# EAGLE design DEC3 (EAGLE 9.4.2)
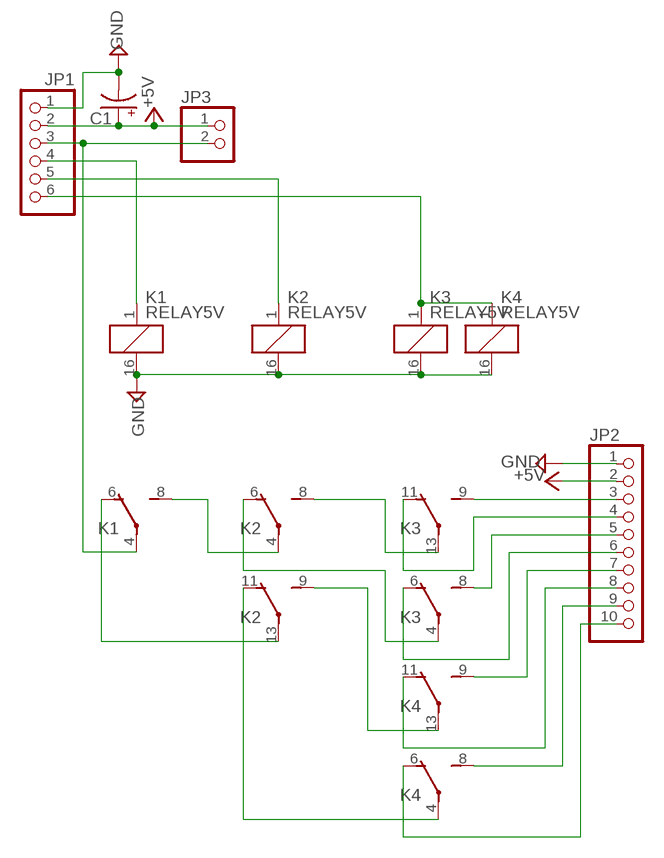
[diagram p0: schematic, sheet 1]

## Parts
C1  CC-5-8.5  [E5-8,5]
JP1  PINHD-1X6  [1X06]
JP2  PINHD-1X10  [1X10]
JP3  PINHD-1X2  [1X02]
K1  RELAY5V  [DS-BT]
K2  RELAY5V  [DS-BT]
K3  RELAY5V  [DS-BT]
K4  RELAY5V  [DS-BT]

## Nets
+5V: C1.+ JP1.2 JP2.2 JP3.1
GND: C1.- JP1.1 JP2.1 K1.16(1:-) K2.16(1:-) K3.16(1:-) K4.16(1:-)
N$1: K1.8(2:S) K2.4(2:P)
N$2: K1.6(2:O) K2.13(3:P)
N$3: K2.8(2:S) K3.13(3:P)
N$4: K2.6(2:O) K3.4(2:P)
N$5: K2.9(3:S) K4.13(3:P)
N$6: K2.11(3:O) K4.4(2:P)
N$7: JP2.3 K3.9(3:S)
N$8: JP2.4 K3.11(3:O)
N$9: JP2.5 K3.8(2:S)
N$10: JP2.6 K3.6(2:O)
N$11: JP2.7 K4.9(3:S)
N$12: JP2.8 K4.11(3:O)
N$13: JP2.9 K4.8(2:S)
N$14: JP2.10 K4.6(2:O)
N$16: JP1.6 K3.1(1:+) K4.1(1:+)
N$19: JP1.4 K1.1(1:+)
N$20: JP1.5 K2.1(1:+)
N$35: JP1.3 JP3.2 K1.4(2:P)
Unconnected: K1.9(3:S) K1.11(3:O) K1.13(3:P)

## Library data of the parts
C1 = Passive_Robotech:CC
JP1 = pinhead:PINHD-1X6: PIN HEADER
JP2 = pinhead:PINHD-1X10: PIN HEADER
JP3 = pinhead:PINHD-1X2: PIN HEADER
K1-K4 = My:RELAY: DS-BT RELAYS 4,000 V BREAKDOWN VOLTAGE NAiS Source: http://www.mew-europe.com/.. en_ds_61005_0010.pdf

## Net classes
0 default: width 0.406 mm

## Board
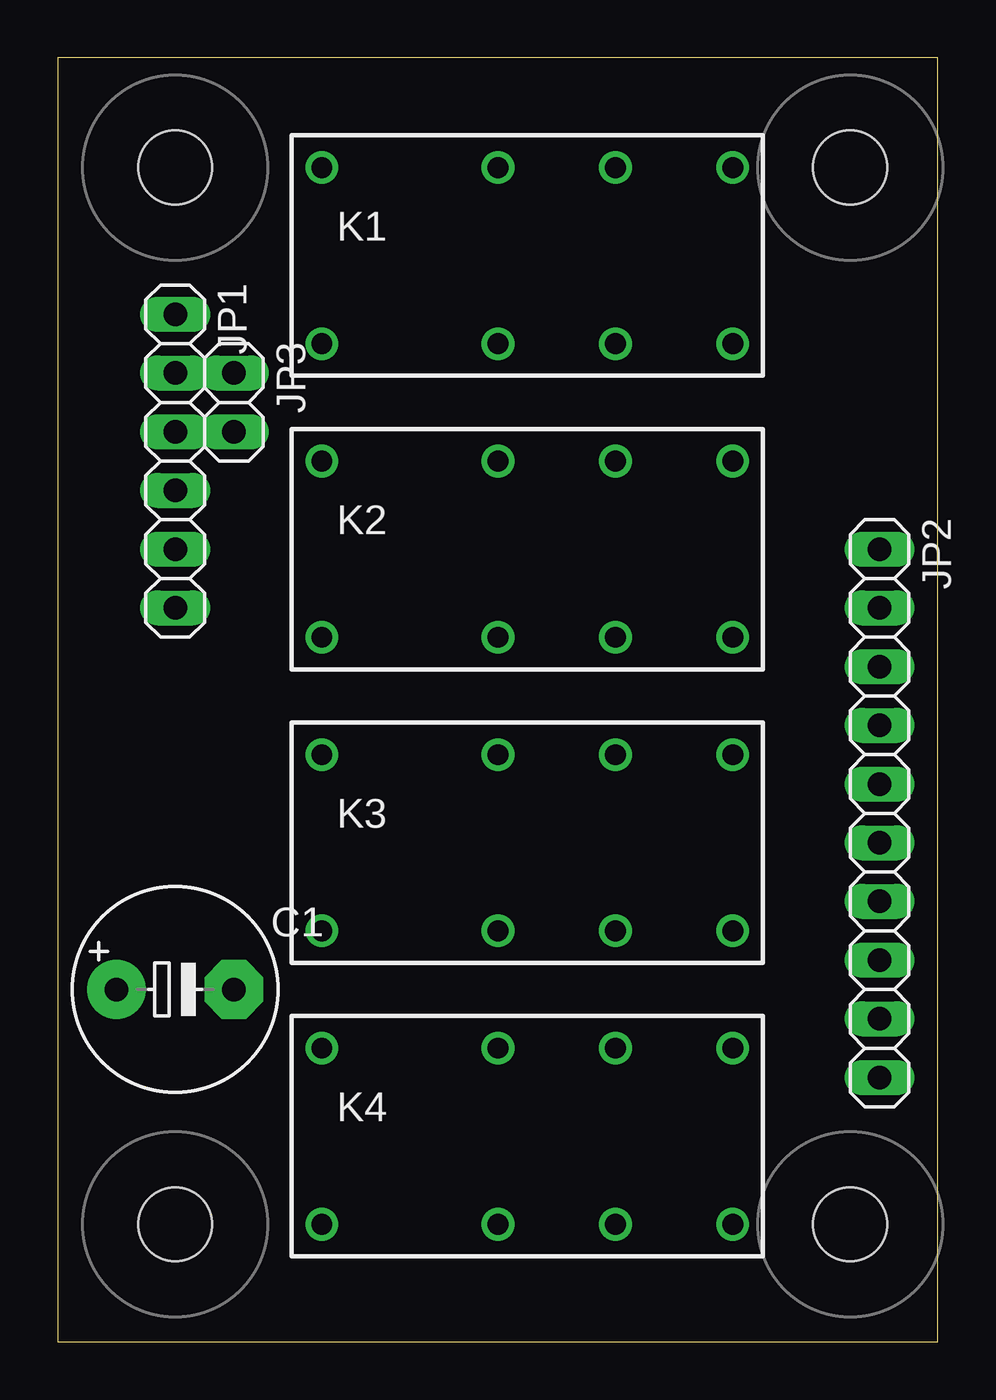
[diagram p1: board, top side]
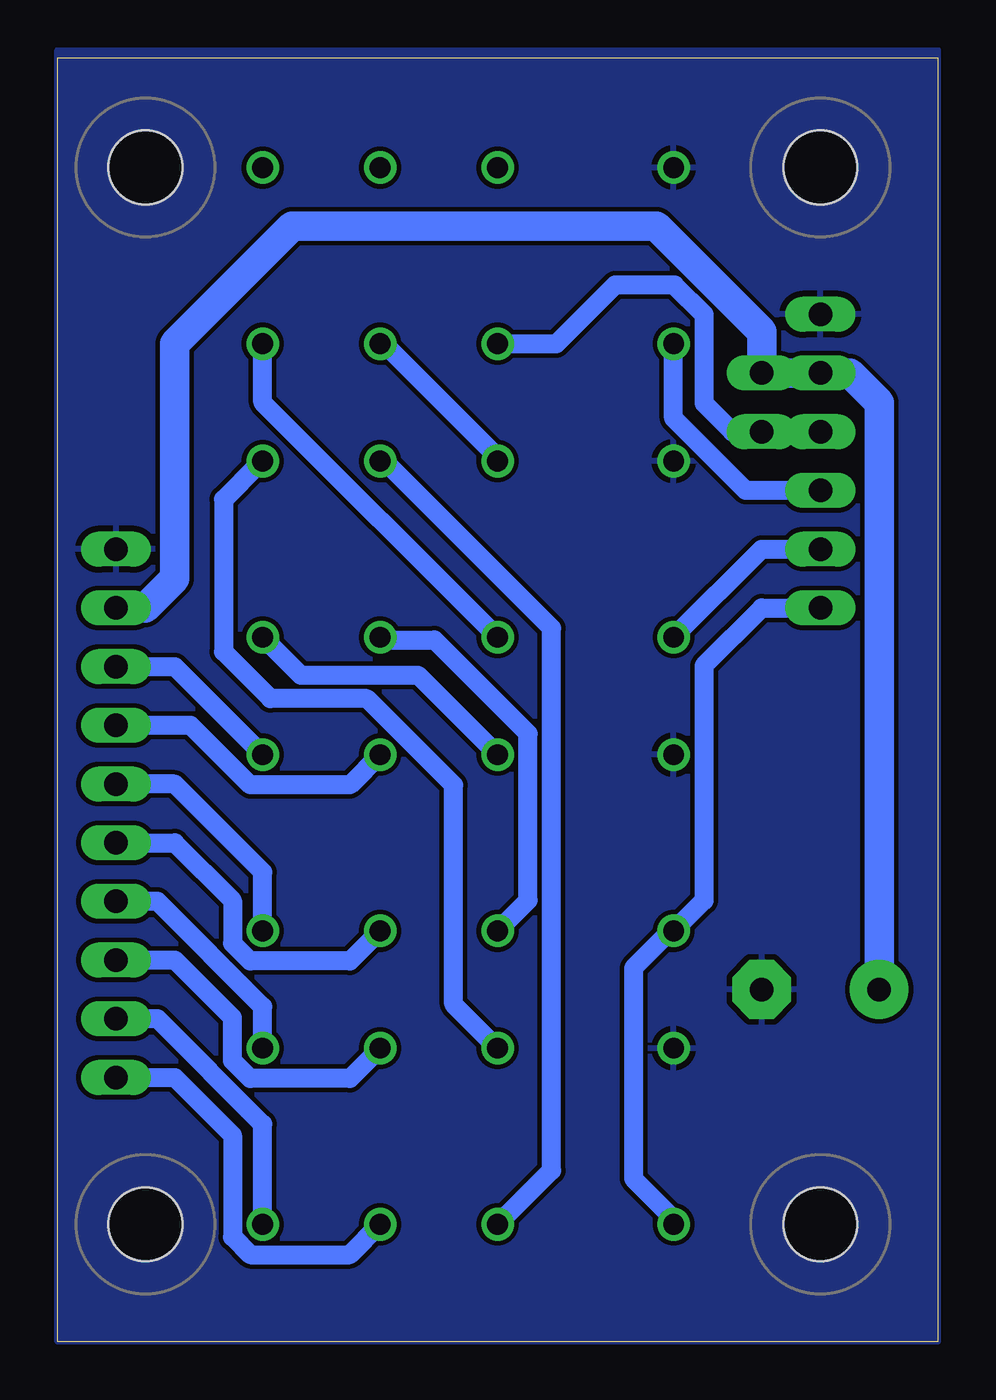
[diagram p2: board, bottom side, seen from below]

Size 38.08 x 55.55 mm. Coordinates in mm from the lower left corner, seen from the top.
Outline: 0,0 38.08,0 38.08,55.55 0,55.55 0,0
Copper layers (1*16): Top 0.0356mm / dielectric 1.5011mm / Bottom 0.0356mm
Design rules "formitaminimum": minimum track width 5mil, minimum drill 0.5994mm, track to track 0.2007mm, track to pad 0.2007mm, pad to pad 0.2007mm, via to via 0.2007mm, smd to smd 0mil, copper to edge 0mil, drill to drill 1mil, minimum pad ring 10mil, minimum via ring 8mil, stop-mask expansion 4mil, vias tented up to drill 1mm, thermal gap 10mil

### Footprints (pad centres in the part's own frame; a part is rotated, then mirrored left to right if it is on the bottom)
E5-8,5 = drill 1.016 pad 2.54: + -2.54,0 | drill 1.016 pad 2.54 octagon: - 2.54,0
1X06 = drill 1.016 long: 1 -6.35,0; 2 -3.81,0; 3 -1.27,0; 4 1.27,0; 5 3.81,0; 6 6.35,0
1X10 = drill 1.016 long: 1 -11.43,0; 2 -8.89,0; 3 -6.35,0; 4 -3.81,0; 5 -1.27,0; 6 1.27,0; 7 3.81,0; 8 6.35,0; 9 8.89,0; 10 11.43,0
1X02 = drill 1.016 long: 1 -1.27,0; 2 1.27,0
DS-BT = drill 0.9: 1 -8.89,-3.81; 4 -1.27,-3.81; 6 3.81,-3.81; 8 8.89,-3.81; 9 8.89,3.81; 11 3.81,3.81; 13 -1.27,3.81; 16 -8.89,3.81
HOLE_3.2 = hole 3.2: 0,0

### Placement (x,y rotation side)
C1  5.08,15.24 0 top
JP1  5.08,38.1 270 top
JP2  35.56,22.86 270 top
JP3  7.62,40.64 270 top
K1  20.32,46.99 0 top
K2  20.32,34.29 0 top
K3  20.32,21.59 0 top
K4  20.32,8.89 0 top
U$1  [HOLE_3.2]  5.08,5.08 0 top
U$2  [HOLE_3.2]  5.08,50.8 0 top
U$3  [HOLE_3.2]  34.29,5.08 0 top
U$4  [HOLE_3.2]  34.29,50.8 0 top

### Tracks (layer width: path | path; a pad name or v marks a point on that pad's centre or on a via)
+5V
  Bottom 1.27: C1.+ 2.54,40.64 3.81,41.91 JP1.2 JP3.1 7.62,43.71 12.17,48.26 27.94,48.26 33.02,43.18 33.02,33.02 34.29,31.75 JP2.2
GND
  pour Bottom: 0,0 38.1,0 38.1,55.88 0,55.88
N$1
  Bottom 0.813: K2.4 29.21,40.64 K1.8
N$2
  Bottom 0.813: K2.13 19.25,38.47 23.81,43.03 K1.6
N$3
  Bottom 0.813: K3.13 22.49,28.84 27.57,28.84 K2.8
N$4
  Bottom 0.813: K2.6 23.81,30.36 21.78,30.36 17.73,26.31 17.73,19.1 K3.4
N$5
  Bottom 0.813: K2.9 29.39,37.96 30.91,36.44 30.91,29.86 28.88,27.83 24.7,27.83 20.95,24.08 20.95,14.61 K4.13
N$6
  Bottom 0.813: K2.11 23.81,37.96 16.72,30.87 16.72,7.41 K4.4
N$7
  Bottom 0.813: JP2.3 33.02,29.21 K3.9
N$8
  Bottom 0.813: K3.11 25.44,24.09 29.75,24.09 32.33,26.67 JP2.4
N$9
  Bottom 0.813: K3.8 29.21,20.32 33.02,24.13 JP2.5
N$10
  Bottom 0.813: K3.6 25.44,16.47 29.75,16.47 30.52,17.24 30.52,19.09 33.02,21.59 JP2.6
N$11
  Bottom 0.813: K4.9 29.21,14.49 33.77,19.05 JP2.7
N$12
  Bottom 0.813: JP2.8 33.02,16.51 30.52,14.01 30.52,12.16 29.75,11.39 25.44,11.39 K4.11
N$13
  Bottom 0.813: K4.8 29.21,9.41 33.77,13.97 JP2.9
N$14
  Bottom 0.813: JP2.10 33.02,11.43 30.52,8.93 30.52,4.54 29.75,3.77 25.44,3.77 K4.6
N$16
  Bottom 0.813: K4.1 11.65,5.53 13.17,7.05 13.17,16.17 11.65,17.69 K3.1 10.12,19.09 10.12,29.25 7.62,31.75 JP1.6
N$19
  Bottom 0.813: K1.1 11.43,39.95 8.31,36.83 JP1.4
N$20
  Bottom 0.813: K2.1 7.62,34.29 JP1.5
N$35
  Bottom 0.813: K1.4 16.51,43.18 13.97,45.72 11.39,45.72 10.12,44.45 10.12,40.6 8.89,39.37 JP3.2 JP1.3